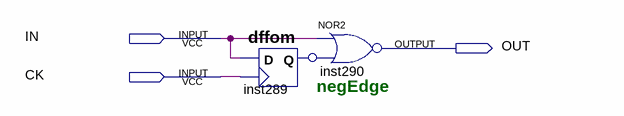
[diagram p0: schematic sheet]
// Quartus schematic NegFl.bdf as structural Verilog: 2 symbols, 3 pins
module NegFl (
  input  IN,
  input  CK,
  output OUT
);

  wire inst289_q, inst289_Q_inverted_out;

  dffom inst289 (.D(IN), .CK(CK), .Q(inst289_q));
  not inst289_Q_inverted (inst289_Q_inverted_out, inst289_q);
  nor inst290 (OUT, IN, inst289_Q_inverted_out);

  // Notes on the sheet:
  //   negEdge
endmodule
